# EAGLE schematic ElectronicsSchematic v7 (EAGLE 9.7.0)
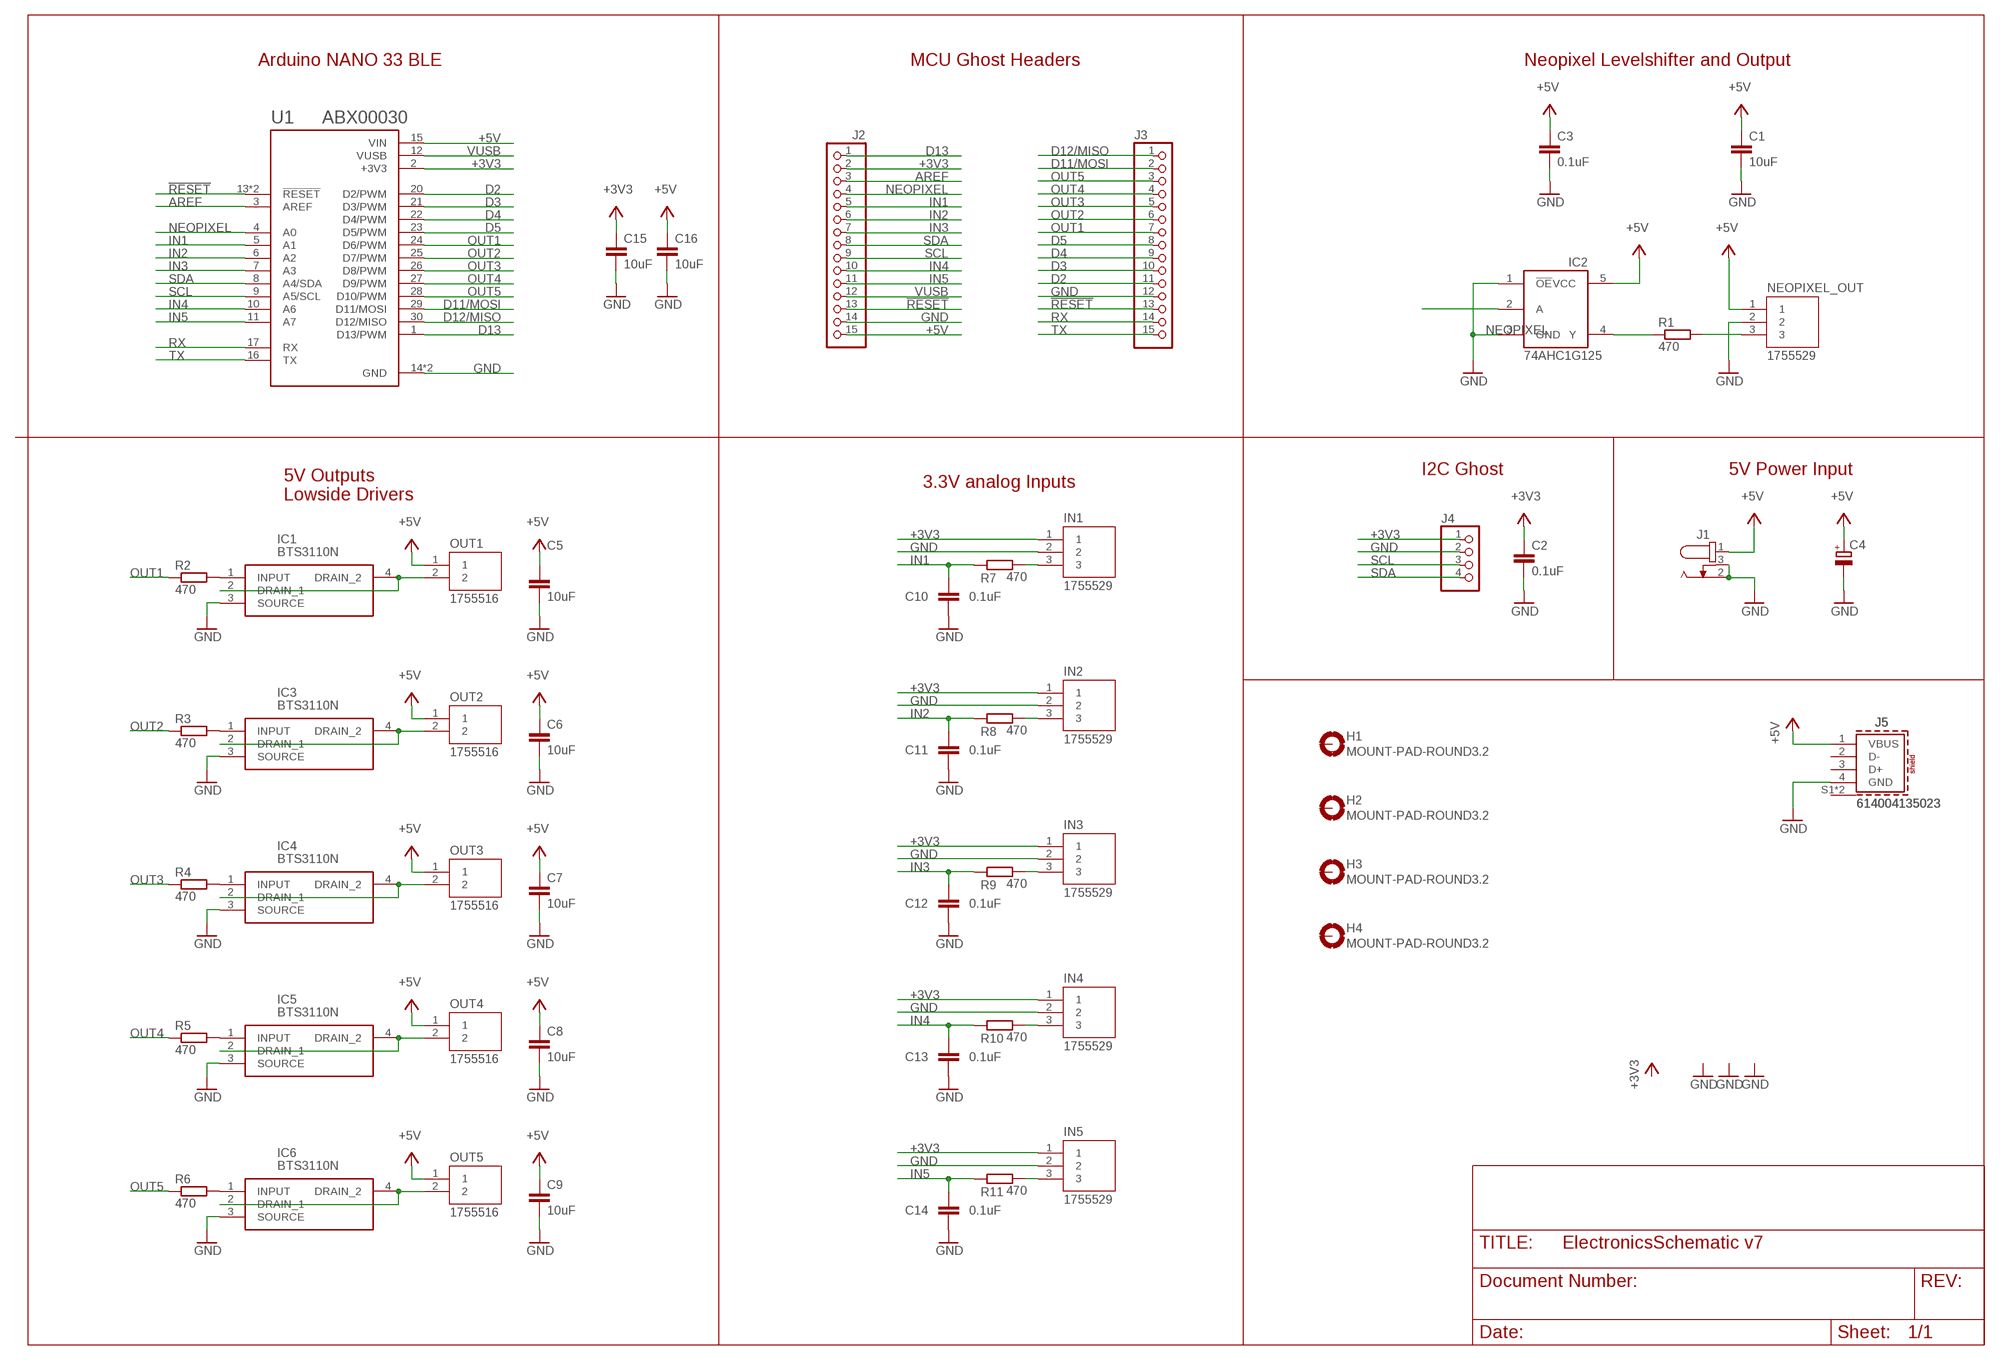
[diagram p0: schematic, sheet 1]

## Parts
C1  10uF  C-EUC0805  [C0805]
C2  0.1uF  C-EUC0603  [C0603]
C3  0.1uF  C-EUC0603  [C0603]
C4  CPOL-EUE3.5-8  [E3,5-8]
C5  10uF  C-EUC0805  [C0805]
C6  10uF  C-EUC0805  [C0805]
C7  10uF  C-EUC0805  [C0805]
C8  10uF  C-EUC0805  [C0805]
C9  10uF  C-EUC0805  [C0805]
C10  0.1uF  C-EUC0603  [C0603]
C11  0.1uF  C-EUC0603  [C0603]
C12  0.1uF  C-EUC0603  [C0603]
C13  0.1uF  C-EUC0603  [C0603]
C14  0.1uF  C-EUC0603  [C0603]
C15  10uF  C-EUC0805  [C0805]
C16  10uF  C-EUC0805  [C0805]
H1  MOUNT-PAD-ROUND3.2  [3,2-PAD]
H2  MOUNT-PAD-ROUND3.2  [3,2-PAD]
H3  MOUNT-PAD-ROUND3.2  [3,2-PAD]
H4  MOUNT-PAD-ROUND3.2  [3,2-PAD]
IC1  BTS3110N  [SOT230P700X170-4N]
IC2  74AHC1G125  [SOT23-5L]
IC3  BTS3110N  [SOT230P700X170-4N]
IC4  BTS3110N  [SOT230P700X170-4N]
IC5  BTS3110N  [SOT230P700X170-4N]
IC6  BTS3110N  [SOT230P700X170-4N]
IN1  1755529  [PHOENIX_1755529]
IN2  1755529  [PHOENIX_1755529]
IN3  1755529  [PHOENIX_1755529]
IN4  1755529  [PHOENIX_1755529]
IN5  1755529  [PHOENIX_1755529]
J1  694106402002  [694106402002]
J2  PINHD-1X15  [1X15]
J3  PINHD-1X15  [1X15]
J4  PINHD-1X4  [1X04]
J5  614004135023  [614004135023]
NEOPIXEL_OUT  1755529  [PHOENIX_1755529]
OUT1  1755516  [PHOENIX_1755516]
OUT2  1755516  [PHOENIX_1755516]
OUT3  1755516  [PHOENIX_1755516]
OUT4  1755516  [PHOENIX_1755516]
OUT5  1755516  [PHOENIX_1755516]
R1  470  R-EU_R1206  [R1206]
R2  470  R-EU_R1206  [R1206]
R3  470  R-EU_R1206  [R1206]
R4  470  R-EU_R1206  [R1206]
R5  470  R-EU_R1206  [R1206]
R6  470  R-EU_R1206  [R1206]
R7  470  R-EU_R1206  [R1206]
R8  470  R-EU_R1206  [R1206]
R9  470  R-EU_R1206  [R1206]
R10  470  R-EU_R1206  [R1206]
R11  470  R-EU_R1206  [R1206]
U1  ABX00030  ABX00030MODULE_ABX00030  [MODULE_ABX00030]

## Nets
!RESET: J2.13 J3.13 U1.13(!RESET) U1.18(!RESET)
+3V3: C2.1 C15.1 IN1.1 IN2.1 IN3.1 IN4.1 IN5.1 J2.2 J4.1 U1.2(+3V3)
+5V: C1.1 C3.1 C4.+ C5.1 C6.1 C7.1 C8.1 C9.1 C16.1 IC2.5(VCC) J1.1 J2.15 J5.1(VBUS) NEOPIXEL_OUT.1 OUT1.1 OUT2.1 OUT3.1 OUT4.1 OUT5.1 U1.15(VIN)
AREF: J2.3 U1.3(AREF)
D2: J3.11 U1.20(D2/PWM)
D3: J3.10 U1.21(D3/PWM)
D4: J3.9 U1.22(D4/PWM)
D5: J3.8 U1.23(D5/PWM)
D11/MOSI: J3.2 U1.29(D11/MOSI)
D12/MISO: J3.1 U1.30(D12/MISO)
D13: J2.1 U1.1(D13/PWM)
GND: C1.2 C2.2 C3.2 C4.- C5.2 C6.2 C7.2 C8.2 C9.2 C10.2 C11.2 C12.2 C13.2 C14.2 C15.2 C16.2 IC1.3(SOURCE) IC2.1(!OE) IC2.3(GND) IC3.3(SOURCE) IC4.3(SOURCE) IC5.3(SOURCE) IC6.3(SOURCE) IN1.2 IN2.2 IN3.2 IN4.2 IN5.2 J1.2 J1.3 J2.14 J3.12 J4.2 J5.4(GND) NEOPIXEL_OUT.2 U1.14(GND) U1.19(GND)
IN1: C10.1 J2.5 R7.1 U1.5(A1)
IN2: C11.1 J2.6 R8.1 U1.6(A2)
IN3: C12.1 J2.7 R9.1 U1.7(A3)
IN4: C13.1 J2.10 R10.1 U1.10(A6)
IN5: C14.1 J2.11 R11.1 U1.11(A7)
N$1: IC1.1(INPUT) R2.2
N$2: NEOPIXEL_OUT.3 R1.2
N$3: IN2.3 R8.2
N$4: IC2.4(Y) R1.1
N$5: IC1.2(DRAIN_1) IC1.4(DRAIN_2) OUT1.2
N$6: IC3.1(INPUT) R3.2
N$7: IC3.2(DRAIN_1) IC3.4(DRAIN_2) OUT2.2
N$8: IN3.3 R9.2
N$9: IC4.1(INPUT) R4.2
N$10: IC4.2(DRAIN_1) IC4.4(DRAIN_2) OUT3.2
N$11: IN1.3 R7.2
N$12: IC5.1(INPUT) R5.2
N$13: IC5.2(DRAIN_1) IC5.4(DRAIN_2) OUT4.2
N$14: IN4.3 R10.2
N$15: IC6.1(INPUT) R6.2
N$16: IC6.2(DRAIN_1) IC6.4(DRAIN_2) OUT5.2
N$17: IN5.3 R11.2
NEOPIXEL: IC2.2(A) J2.4 U1.4(A0)
OUT1: J3.7 R2.1 U1.24(D6/PWM)
OUT2: J3.6 R3.1 U1.25(D7/PWM)
OUT3: J3.5 R4.1 U1.26(D8/PWM)
OUT4: J3.4 R5.1 U1.27(D9/PWM)
OUT5: J3.3 R6.1 U1.28(D10/PWM)
RX: J3.14 U1.17(RX)
SCL: J2.9 J4.3 U1.9(A5/SCL)
SDA: J2.8 J4.4 U1.8(A4/SDA)
TX: J3.15 U1.16(TX)
VUSB: J2.12 U1.12(VUSB)
Unconnected: H1.B3,2(MOUNT) H2.B3,2(MOUNT) H3.B3,2(MOUNT) H4.B3,2(MOUNT) J5.2(D-) J5.3(D+) J5.S1(SHIELD) J5.S2(SHIELD)

## Notes on the sheet
- Arduino NANO 33 BLE | MCU Ghost Headers | Neopixel Levelshifter and Output
- I2C Ghost | 5V Power Input
- 3.3V analog Inputs
- 5V Outputs
  Lowside Drivers

## Library data of the parts
C1-C3 C5-C16 = rcl:C-EU: CAPACITOR, European symbol; SPICEPREFIX: C
C4 = rcl:CPOL-EU: POLARIZED CAPACITOR, European symbol; SPICEPREFIX: C
H1-H4 = holes:MOUNT-PAD-ROUND: MOUNTING PAD, round
IC1 IC3-IC6 = SamacSys_Parts:BTS3110N: Infineon BTS3110N, Multiplexer Switch IC Power, 4-Pin SOT-223 Source: Datasheet <https://www.infineon.com/dgdl/Infineon-BTS3110N-DS-v01_03-EN.pdf?fileId=5546d4625a888733015aad668d4b4bef>; ARROW_PART_NUMBER: BTS3110N; DESCRIPTION: Infineon BTS3110N, Multiplexer Switch IC Power, 4-Pin SOT-223; HEIGHT: 1.7mm; MANUFACTURER_NAME: Infineon; MANUFACTURER_PART_NUMBER: BTS3110N; MOUSER_PART_NUMBER: 726-BTS3110N; MOUSER_PRICE-STOCK: https://www.mouser.co.uk/ProductDetail/Infineon-Technologies/BTS3110N?qs=mzcOS1kGbgdbbkeYFm%2FVOQ%3D%3D
IC2 = adafruit:74AHC1G125
IN1-IN5 NEOPIXEL_OUT = Phoenix_MSTBVA:1755529: 3 Position Terminal Block Header, Male Pins, Shrouded (4 Side) 0.197" (5.00mm) Vertical Through Hole; MANUFACTURER: Phoenix Contact; MAXIMUM_PACKAGE_HEIGHT: 12.15mm; PARTREV: 04; STANDARD: Manufacturer Recommendations
J1 = Wurth_Connectors_WR-DC:694106402002: WR-DC DC Power Jack Vertical THT Ø 6.4 KIND PROPERTIES Quality Class 5 000 Mating cycles Type Vertical MATERIAL PROPERTIES Insulator Material PA66 Insulator Flammability Rating UL94 V-0 Color Black Contact Material Copper Alloy Contact Type Stamped Center Pin Plating Gold Center Pin Terminal Plating Tin Tip Spring Material Tin Shunt Terminal Plating Tin GENERAL INFORMATION Operating Temperature -40 up to +85 °C Compliance RoHS ELECTRICAL PROPERTIES IR 1 3 A Working Voltage 20 V (AC) Withstanding Voltage 500 V (AC) Contact Resistance 50 mΩ RISO 100 MΩ PACKAGING PROPERTIES Packaging Bag <https://katalog.we-online.com/media/images/v2/o64599v209%20Family_WR-DC_THT_6941xx402002_pf2.jpg> Details see: https://katalog.we-online.com/en/em/DC_THT_VERTICAL_6_4_69410X402002 Updated by Ella Wu 2019-11-01 2019(C) Wurth Elektronik; DATASHEET-URL: https://katalog.we-online.com/em/datasheet/694106402002.pdf; IR: 3A; MOUNT: THT; PART-NUMBER: 694106402002; TYPE: Vertical; WORKING-VOLTAGE: 20V(AC)
J2 J3 = pinhead:PINHD-1X15: PIN HEADER
J4 = pinhead:PINHD-1X4: PIN HEADER
J5 = Wurth_Connectors_WR-USB:614004135023: WR-COM USB 2.0 Type A Vertical Kind Properties Durability:1500 Mating cycles Quality Class:1 500 Mating cycles Connector Type:USB Gender:Receptacle Type:Vertical General Information Operating Temperature:-40up to +105 °C Compliance:RoHS Electrical Properties IR 1:1.5 A Working Voltage:30V (AC) Withstanding Voltage:750V (AC) Contact Resistance:20 mΩ Material Properties Insulator Material:PBT Insulator Flammability Rating:UL94 V-0 Color:White Cover Material:Brass Cover Plating:Nickel Contact Material:Copper Alloy Contact Plating:Selective Gold Contact Type:Stamped Shielding Material:Brass Shielding Plating:Nickel <https://www.we-online.com/catalog/media/o32979v209%20Family_WR-COM_614004135023.jpg> Details see: https://www.we-online.com/catalog/en/COM_TYPE_A_VERTICAL/ Updated by Yingchun, Shan 2020-01-15 2020 (C) Würth Elektronik; APPLICATION: USB 2.0; DATASHEET-URL: https://www.we-online.com/catalog/datasheet/614004135023.pdf; GERDER: Receptacle; INTERFACE-TYPE: Type A; IR1: 1.5A; MOUNT: THT; PACKAGING: Tray; PART-NUMBER: 614004135023; PINS: 4; TYPE: Vertical; WORKING-VOLTAGE: 30V(AC)
OUT1-OUT5 = Phoenix_MSTBVA:1755516
R1-R11 = rcl:R-EU_: RESISTOR, European symbol; SPICEPREFIX: R
U1 = ABX00027:ABX00030: ATSAMD21G18A Arduino Nano 33 IoT SAM D ARM® Cortex®-M0+ MCU 32-Bit Embedded Evaluation Board